# EAGLE design MatrixMadeEZv3 (EAGLE 9.4.2)

## Sheet 1 of 2
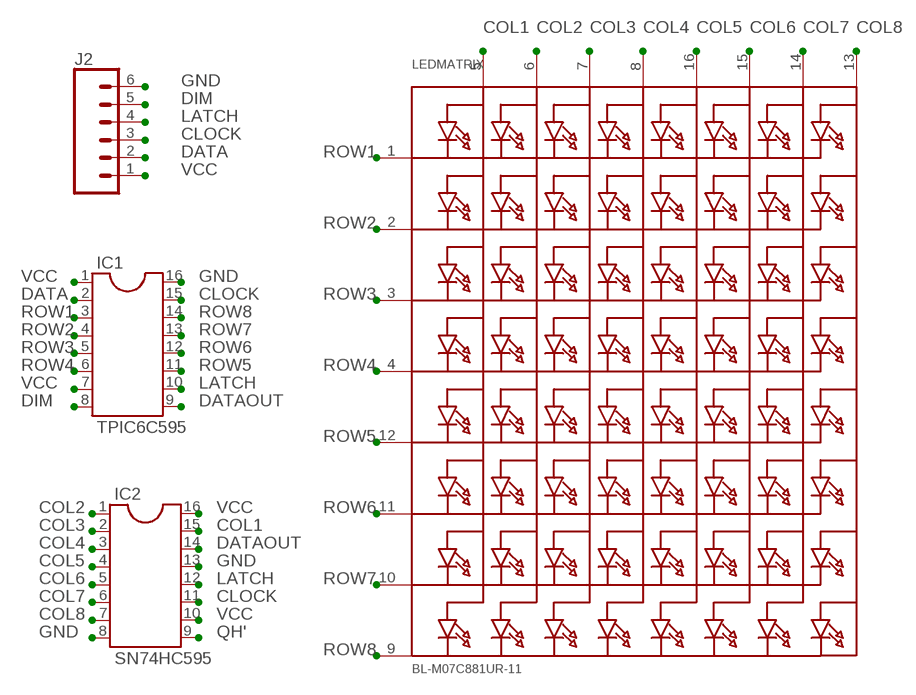
[diagram p0: schematic, sheet 1]

### Parts
IC1  TPIC6C595  DIL16  [DIL16]
IC2  SN74HC595  DIL16  [DIL16]
J2  CONN_06LONGPADS  [1X06_LONGPADS]
LEDMATRIX  BL-M07C881UR-11  SEGMENT_8X8_ROWCATHODE  [SEGMENT_BL-M07C881UR]

### Nets
CLOCK: IC1.15 IC2.11 J2.3
COL1: IC2.15 LEDMATRIX.5(A1)
COL2: IC2.1 LEDMATRIX.6(A2)
COL3: IC2.2 LEDMATRIX.7(A3)
COL4: IC2.3 LEDMATRIX.8(A4)
COL5: IC2.4 LEDMATRIX.16(A5)
COL6: IC2.5 LEDMATRIX.15(A6)
COL7: IC2.6 LEDMATRIX.14(A7)
COL8: IC2.7 LEDMATRIX.13(A8)
DATA: IC1.2 J2.2
DATAOUT: IC1.9 IC2.14
DIM: IC1.8 J2.5
GND: IC1.16 IC2.8 IC2.13 J2.6
LATCH: IC1.10 IC2.12 J2.4
QH': IC2.9
ROW1: IC1.3 LEDMATRIX.1(K1)
ROW2: IC1.4 LEDMATRIX.2(K2)
ROW3: IC1.5 LEDMATRIX.3(K3)
ROW4: IC1.6 LEDMATRIX.4(K4)
ROW5: IC1.11 LEDMATRIX.12(K5)
ROW6: IC1.12 LEDMATRIX.11(K6)
ROW7: IC1.13 LEDMATRIX.10(K7)
ROW8: IC1.14 LEDMATRIX.9(K8)
VCC: IC1.1 IC1.7 IC2.10 IC2.16 J2.1

## Sheet 2 of 2

## Library data of the parts
IC1 IC2 = ic-package:DIL16: Dual In Line / Socket
J2 = SparkFun-Connectors:CONN_06: Multi connection point. Often used as Generic Header-pin footprint for 0.1 inch spaced/style header connections On any of the 0.1 inch spaced packages, you can populate with these: Break Away Headers - Straight <https://www.sparkfun.com/products/116> (PRT-00116) Break Away Male Headers - Right Angle <https://www.sparkfun.com/products/553> (PRT-00553) Female Headers <https://www.sparkfun.com/products/115> (PRT-00115) Break Away Headers - Machine Pin <https://www.sparkfun.com/products/117> (PRT-00117) Break Away Female Headers - Swiss Machine Pin <https://www.sparkfun.com/products/743> (PRT-00743) Arduino Stackable Header - 6 Pin <https://www.sparkfun.com/products/9280> (PRT-09280) For SCREWTERMINALS and SPRING TERMINALS visit here: Screw Terimnals on SparkFun.com <https://www.sparkfun.com/search/results?term=Screw+Terminals> (5mm/3.5mm/2.54mm spacing) This device is also useful as a general connection point to wire up your design to another part of your project. Our various solder wires solder well into these plated through hole pads. Hook-Up Wire - Assortment (Stranded, 22 AWG) <https://www.sparkfun.com/products/11375> (PRT-11375) Hook-Up Wire - Assortment (Solid Core, 22 AWG) <https://www.sparkfun.com/products/11367> (PRT-11367) View the entire wire category on our website here <https://www.sparkfun.com/categories/141>
LEDMATRIX = adafruit:SEGMENT_8X8_ROWCATHODE: 8x8 LED Segment Displays: Row = Cathode 0.7" Red 8X8 Matrix, 1.9mm Round LEDs - BL-M07C881UR 1.2" Red 8x8 Matrix, 3.0mm Round LEDs - BL-M12A881UR 1.2" Red 8x8 Matrix, 3.0mm Square LEDs - BL-M12A883

## Board
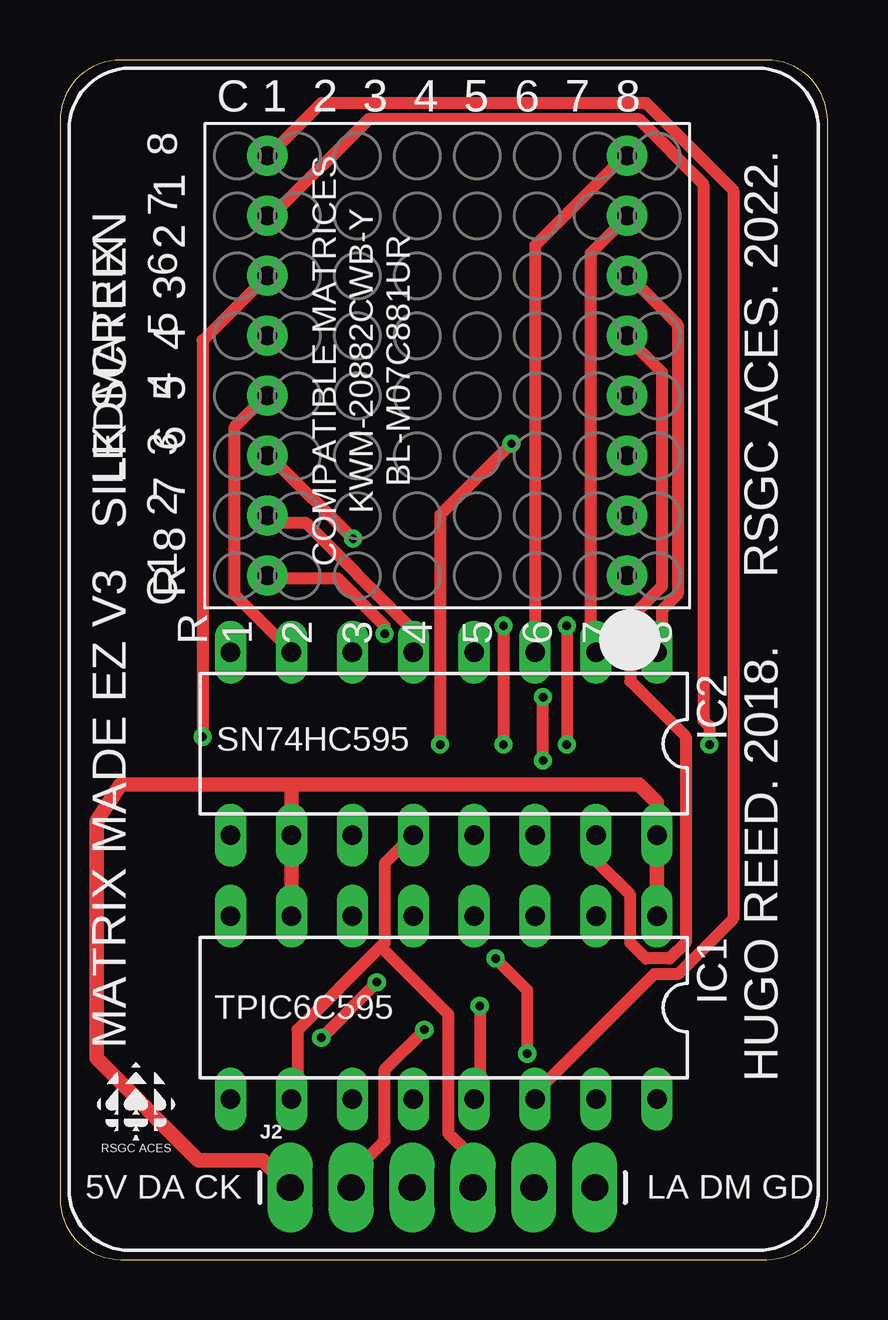
[diagram p1: board, top side]
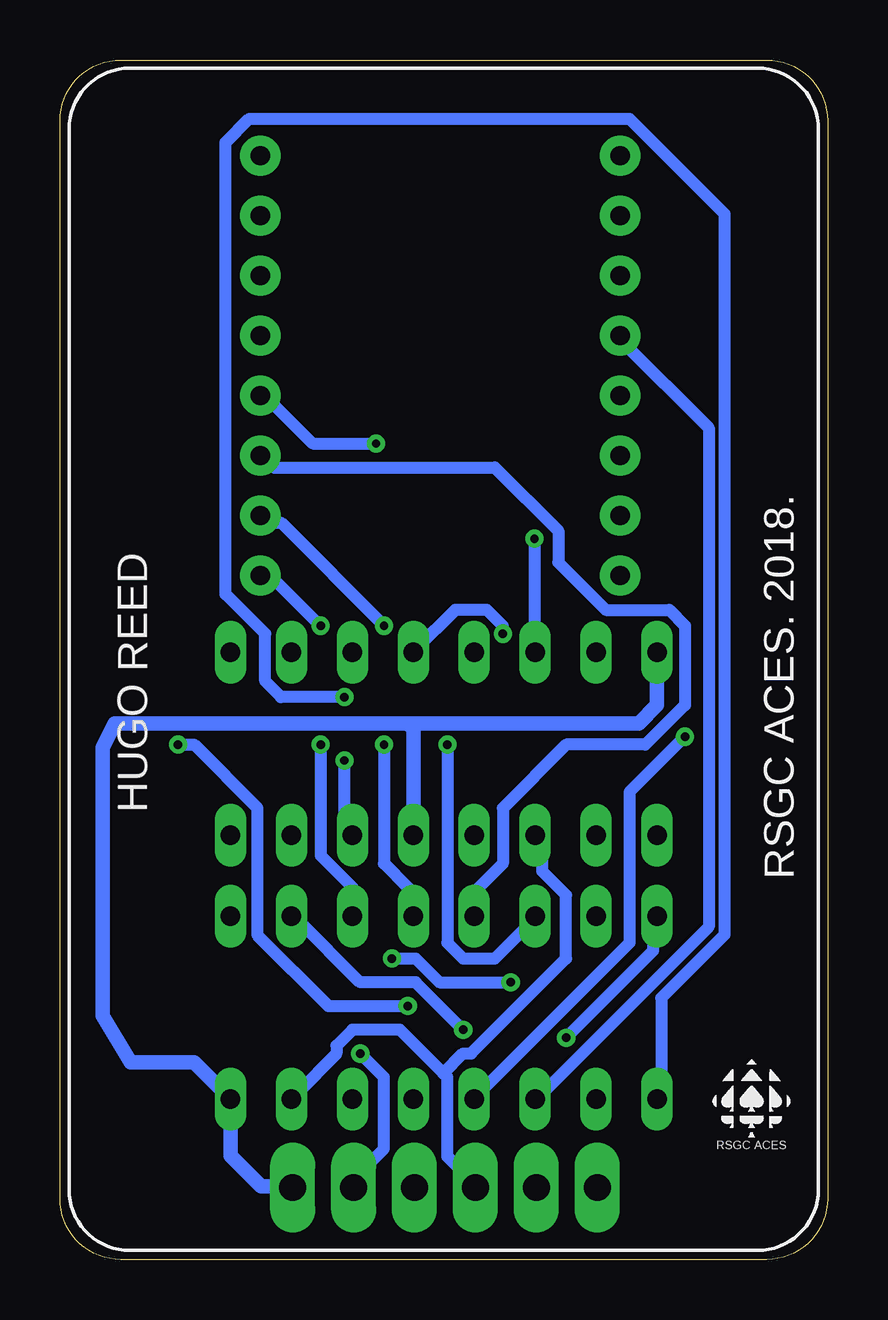
[diagram p2: board, bottom side, seen from below]

Size 32 x 50 mm. Coordinates in mm from the lower left corner, seen from the top.
Outline: 0,47.46 0,2.54 arc90 2.54,0 29.46,0 arc90 32,2.54 32,47.46 arc90 29.46,50 2.54,50 arc90 0,47.46
Copper layers (1*16): Top 0.035mm / dielectric 1.5mm / Bottom 0.035mm
Design rules "default *": minimum track width 20mil, minimum drill 0.35mm, track to track 6mil, track to pad 6mil, pad to pad 6mil, via to via 6mil, smd to smd 6mil, copper to edge 40mil, drill to drill 6mil, minimum pad ring 10mil, minimum via ring 8mil, stop-mask expansion 4mil, vias tented up to drill 0mil, thermal gap 10mil

### Footprints (pad centres in the part's own frame; a part is rotated, then mirrored left to right if it is on the bottom)
DIL16 = drill 0.813 long: 1 -8.89,-3.81; 2 -6.35,-3.81; 3 -3.81,-3.81; 4 -1.27,-3.81; 5 1.27,-3.81; 6 3.81,-3.81; 7 6.35,-3.81; 8 8.89,-3.81; 9 8.89,3.81; 10 6.35,3.81; 11 3.81,3.81; 12 1.27,3.81; 13 -1.27,3.81; 14 -3.81,3.81; 15 -6.35,3.81; 16 -8.89,3.81
1X06_LONGPADS = drill 1.118 pad 1.88 long: 1 0,0; 2 2.54,0; 3 5.08,0; 4 7.62,0; 5 10.16,0; 6 12.7,0
SEGMENT_BL-M07C881UR = drill 0.8 pad 1.676: 1 -8.75,-7.5; 2 -6.25,-7.5; 3 -3.75,-7.5; 4 -1.25,-7.5; 5 1.25,-7.5; 6 3.75,-7.5; 7 6.25,-7.5; 8 8.75,-7.5; 9 8.75,7.5; 10 6.25,7.5; 11 3.75,7.5; 12 1.25,7.5; 13 -1.25,7.5; 14 -3.75,7.5; 15 -6.25,7.5; 16 -8.75,7.5

### Placement (x,y rotation side)
IC1  16,10.5 180 top
IC2  16,21.5 180 top
J2  9.6,3 0 top
LEDMATRIX  16.14,37.26 90 top
U$1  [SMALL_TSILK_TEXT]  3.17,6.6 0 top
U$6  [SMALL_BSILK_TEXT]  3.17,6.73 0 top

### Tracks (layer width: path | path; a pad name or v marks a point on that pad's centre or on a via)
CLOCK
  Bottom 0.508: 16.02,7.76 15.85,7.59 15.85,4.29 14.86,3.3 J2.3 | 16.02,7.76 17.83,9.58 19.81,9.58 20.47,8.91 20.47,8.59 22.12,6.93 IC1.15 | 16.02,7.76 15.19,8.59 14.86,8.59 10.9,12.55 10.9,15.19 11.89,16.18 11.89,17.5 IC2.11
COL1
  Top 0.508: IC2.15 22.45,17.5 22.45,16.51 23.77,15.19 23.77,13.21 24.43,12.55 25.43,12.55 26.09,13.21 26.09,21.79 23.77,24.11 23.77,26.75 25.09,28.07 25.09,36.98 23.77,38.3 LEDMATRIX.5
COL2
  Top 0.508: IC2.1 25.09,25.43 25.09,27.08 25.76,27.74 25.76,38.96 23.77,40.95 LEDMATRIX.6
COL3
  Top 0.508: IC2.2 22.12,25.43 22.12,41.94 23.44,43.26 LEDMATRIX.7
COL4
  Top 0.508: IC2.3 19.81,25.43 19.81,42.27 23.44,45.9 LEDMATRIX.8
COL5  (via drill 0.35)
  Top 0.508: v13.54,26.09 13.54,26.42 11.56,28.4 8.91,28.4 LEDMATRIX.16
  Bottom 0.508: v13.54,26.09 13.54,26.42 14.2,27.08 15.52,27.08 17.17,25.43 IC2.4
COL6
  Top 0.508: IC2.5 14.53,25.43 14.53,26.42 10.24,30.71 8.91,30.71 LEDMATRIX.15
COL7  (via drill 0.35)
  Top 0.508: v12.22,30.05 8.91,33.35 LEDMATRIX.14
  Bottom 0.508: v12.22,30.05 12.22,25.43 IC2.6
COL8
  Top 0.508: IC2.7 9.58,25.43 7.26,27.74 7.26,34.67 8.59,35.99 LEDMATRIX.13
DATA  (via drill 0.35)
  Top 0.508: v15.19,9.58 13.54,7.92 13.54,4.95 11.89,3.3 J2.2
  Bottom 0.508: v15.19,9.58 17.17,11.56 19.48,11.56 22.12,14.2 IC1.2
DATAOUT  (via drill 0.35)
  Top 0.508: v20.14,20.8 v20.14,23.44
  Bottom 0.508: v20.14,23.44 22.78,23.44 23.44,24.11 23.44,26.09 25.09,27.74 25.09,46.56 24.11,47.55 8.26,47.55 4.29,43.59 4.29,13.54 6.93,10.9 6.93,6.93 IC1.9 | v20.14,20.8 20.14,18.16 19.81,17.83 IC2.14
DIM  (via drill 0.35)
  Top 0.508: v13.21,11.56 v10.9,9.25 | v18.16,12.55 19.48,11.23 v19.48,8.59
  Bottom 0.508: v10.9,9.25 7.26,12.88 7.26,14.2 IC1.8 | v13.21,11.56 16.18,11.56 17.17,12.55 v18.16,12.55 | v19.48,8.59 18.49,7.59 18.49,4.62 19.81,3.3 J2.5
GND
  Bottom 0.61: J2.6 22.35,3.05 23.62,3.05 24.89,4.32 IC1.16 26.41,8.21 29.04,8.21 30.23,10.16 30.23,21.34 29.72,22.35 17.53,22.35 | 17.53,22.35 7.87,22.35 7.11,23.11 IC2.8 | IC2.13 17.27,22.1 17.53,22.35
LATCH
  Top 0.508: 13.37,13.04 13.54,13.21 13.54,16.51 14.53,17.5 IC2.12 | 13.37,13.04 9.91,9.58 9.91,6.93 IC1.10 | 13.37,13.04 16.18,10.24 16.18,5.28 17.17,4.29 17.17,3.3 J2.4
ROW1  (via drill 0.35)
  Top 0.508: v21.13,26.42 v21.13,21.46
  Bottom 0.508: v21.13,21.46 21.13,16.84 19.81,15.52 19.81,14.53 IC1.3 | v21.13,26.42 23.44,28.73 LEDMATRIX.1
ROW2  (via drill 0.35)
  Top 0.508: v18.49,26.42 v18.49,21.46
  Bottom 0.508: v18.49,21.46 18.49,16.51 17.5,15.52 17.5,14.53 IC1.4 | v18.49,26.42 22.78,30.71 23.44,30.71 LEDMATRIX.2
ROW3
  Bottom 0.508: IC1.5 14.53,14.53 14.53,15.52 13.54,16.51 13.54,18.82 10.9,21.46 7.59,21.46 5.94,23.11 5.94,26.42 6.6,27.08 9.25,27.08 11.23,29.06 11.23,30.38 13.87,33.02 23.11,33.02 23.44,33.35 LEDMATRIX.3
ROW4  (via drill 0.35)
  Top 0.508: v15.85,21.46 15.85,31.04 v18.82,34.01
  Bottom 0.508: v15.85,21.46 15.85,13.21 15.19,12.55 13.87,12.55 12.22,14.2 IC1.6 | v18.82,34.01 21.46,34.01 23.44,35.99 LEDMATRIX.4
ROW5
  Bottom 0.508: IC1.11 11.89,6.93 4.95,13.87 4.95,34.67 8.59,38.3 LEDMATRIX.12
ROW6  (via drill 0.35)
  Top 0.508: v5.94,21.79 5.94,38.3 8.59,40.95 LEDMATRIX.11
  Bottom 0.508: v5.94,21.79 8.26,19.48 8.26,13.21 14.53,6.93 IC1.12
ROW7  (via drill 0.35)
  Top 0.508: v17.5,10.57 17.5,6.93 IC1.13 | v27.08,21.46 27.08,22.23 26.82,22.48 26.82,44.83 24.11,47.55 12.88,47.55 8.91,43.59 LEDMATRIX.10
  Bottom 0.508: v17.5,10.57 20.8,10.57 23.77,13.54 23.77,18.82 26.42,21.46 v27.08,21.46
ROW8
  Top 0.508: IC1.14 19.81,6.93 24.77,11.89 25.76,11.89 28.07,14.2 28.07,44.58 24.43,48.21 10.9,48.21 8.91,46.23 LEDMATRIX.9
VCC
  Top 0.61: IC1.1 IC2.16 24.89,19.05 24.13,19.81 9.65,19.81 | IC1.7 IC2.10 9.65,19.81 | 9.65,19.81 2.54,19.81 1.52,18.29 1.52,8.38 5.76,4.14 8.46,4.14 J2.1

### Text on the board
tSilk: C 1 2 3 4 5 6 7 8 | SILK SCREEN | COMPATIBLE MATRICES / KWM-20882CWB-Y / BL-M07C881UR | RSGC ACES. 2022. | R 8 7 6 5 4 3 2 1 | SN74HC595 | MATRIX MADE EZ V3 | HUGO REED. 2018. | TPIC6C595 | 5V DA CK | LA DM GD
_bsilk: RSGC ACES. 2018. | HUGO REED